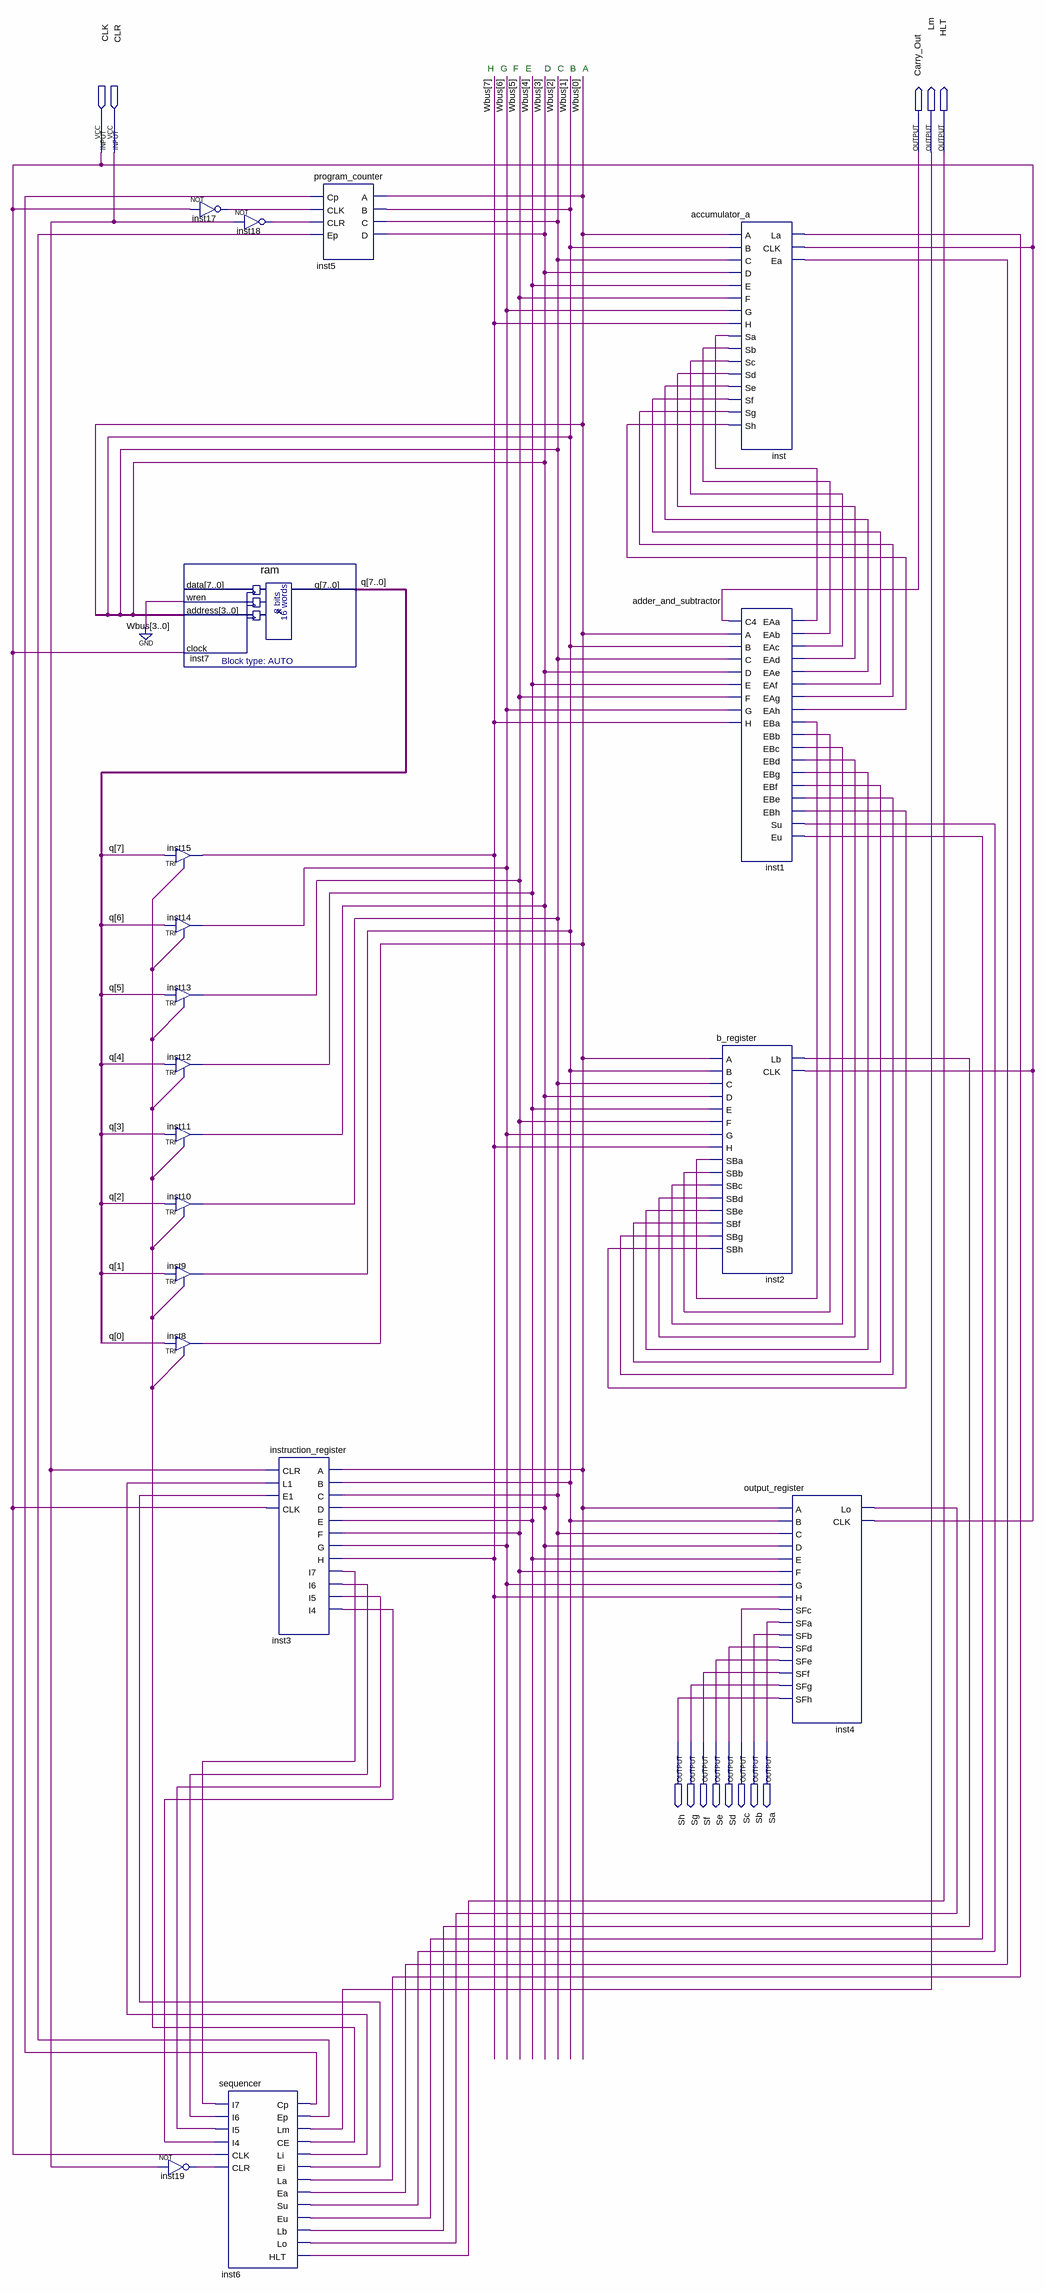
[diagram p0: schematic sheet]
// Quartus schematic microprocessor.bdf as structural Verilog: 19 symbols, 13 pins
module microprocessor (
  input  CLK,
  input  CLR,
  output Carry_Out,
  output Lm,
  output HLT,
  output Sh,
  output Sg,
  output Sf,
  output Se,
  output Sd,
  output Sc,
  output Sb,
  output Sa
);

  wire inst2_sba, inst2_sbb, inst2_sbc, inst2_sbd, inst2_sbe, inst2_sbf, inst2_sbg, inst2_sbh, inst3_i4,
       inst3_i5, inst3_i6, inst3_i7, inst6_ce, inst6_cp, inst6_ea, inst6_ei, inst6_ep, inst6_eu, inst6_la,
       inst6_lb, inst6_li, inst6_lo, inst6_su, inst17_out, inst18_out, inst19_out, inst_sa, inst_sb, inst_sc,
       inst_sd, inst_se, inst_sf, inst_sg, inst_sh;
  wire [7:0] q, Wbus;

  not inst17 (inst17_out, CLK);
  ram inst7 (.wren(1'b0), .address(Wbus[3:0]), .clock(CLK), .q(q));  // open: data
  TRI inst15 (.IN(q[7]), .OE(inst6_ce), .OUT(Wbus[7]));
  TRI inst14 (.IN(q[6]), .OE(inst6_ce), .OUT(Wbus[6]));
  TRI inst13 (.IN(q[5]), .OE(inst6_ce), .OUT(Wbus[5]));
  TRI inst12 (.IN(q[4]), .OE(inst6_ce), .OUT(Wbus[4]));
  TRI inst11 (.IN(q[3]), .OE(inst6_ce), .OUT(Wbus[3]));
  TRI inst10 (.IN(q[2]), .OE(inst6_ce), .OUT(Wbus[2]));
  TRI inst9 (.IN(q[1]), .OE(inst6_ce), .OUT(Wbus[1]));
  TRI inst8 (.IN(q[0]), .OE(inst6_ce), .OUT(Wbus[0]));
  not inst19 (inst19_out, CLR);
  not inst18 (inst18_out, CLR);
  sequencer inst6 (
    .I7(inst3_i7), .I6(inst3_i6), .I5(inst3_i5), .I4(inst3_i4), .CLK(CLK), .CLR(inst19_out), .Cp(inst6_cp),
    .Ep(inst6_ep), .Lm(Lm), .CE(inst6_ce), .Li(inst6_li), .Ei(inst6_ei), .La(inst6_la), .Ea(inst6_ea),
    .Su(inst6_su), .Eu(inst6_eu), .Lb(inst6_lb), .Lo(inst6_lo), .HLT(HLT));
  instruction_register inst3 (
    .CLR(CLR), .L1(inst6_li), .E1(inst6_ei), .CLK(CLK), .I7(inst3_i7), .I6(inst3_i6), .I5(inst3_i5),
    .I4(inst3_i4), .A(Wbus[0]), .B(Wbus[1]), .C(Wbus[2]), .D(Wbus[3]), .E(Wbus[4]), .F(Wbus[5]), .G(Wbus[6]),
    .H(Wbus[7]));
  program_counter inst5 (
    .Cp(inst6_cp), .CLK(inst17_out), .CLR(inst18_out), .Ep(inst6_ep), .A(Wbus[0]), .B(Wbus[1]), .C(Wbus[2]),
    .D(Wbus[3]));
  b_register inst2 (
    .Lb(inst6_lb), .CLK(CLK), .SBa(inst2_sba), .SBb(inst2_sbb), .SBc(inst2_sbc), .SBd(inst2_sbd),
    .SBe(inst2_sbe), .SBf(inst2_sbf), .SBg(inst2_sbg), .SBh(inst2_sbh), .A(Wbus[0]), .B(Wbus[1]),
    .C(Wbus[2]), .D(Wbus[3]), .E(Wbus[4]), .F(Wbus[5]), .G(Wbus[6]), .H(Wbus[7]));
  accumulator_a inst (
    .La(inst6_la), .CLK(CLK), .Ea(inst6_ea), .Sa(inst_sa), .Sb(inst_sb), .Sc(inst_sc), .Sd(inst_sd),
    .Se(inst_se), .Sf(inst_sf), .Sg(inst_sg), .Sh(inst_sh), .A(Wbus[0]), .B(Wbus[1]), .C(Wbus[2]),
    .D(Wbus[3]), .E(Wbus[4]), .F(Wbus[5]), .G(Wbus[6]), .H(Wbus[7]));
  adder_and_subtractor inst1 (
    .EAa(inst_sa), .EAb(inst_sb), .EAc(inst_sc), .EAd(inst_sd), .EAe(inst_se), .EAf(inst_sf), .EAg(inst_sg),
    .EAh(inst_sh), .EBa(inst2_sba), .EBb(inst2_sbb), .EBc(inst2_sbc), .EBd(inst2_sbd), .EBg(inst2_sbe),
    .EBf(inst2_sbf), .EBe(inst2_sbg), .EBh(inst2_sbh), .Su(inst6_su), .Eu(inst6_eu), .C4(Carry_Out),
    .A(Wbus[0]), .B(Wbus[1]), .C(Wbus[2]), .D(Wbus[3]), .E(Wbus[4]), .F(Wbus[5]), .G(Wbus[6]), .H(Wbus[7]));
  output_register inst4 (
    .Lo(inst6_lo), .CLK(CLK), .SFc(Sc), .SFa(Sa), .SFb(Sb), .SFd(Sd), .SFe(Se), .SFf(Sf), .SFg(Sg), .SFh(Sh),
    .A(Wbus[0]), .B(Wbus[1]), .C(Wbus[2]), .D(Wbus[3]), .E(Wbus[4]), .F(Wbus[5]), .G(Wbus[6]), .H(Wbus[7]));

  // Notes on the sheet:
  //   H
  //   G
  //   F
  //   E
  //   D
  //   C
  //   B
  //   A
endmodule
